# Altium schematic sheet Temp Supervisor.SchDoc
size A4
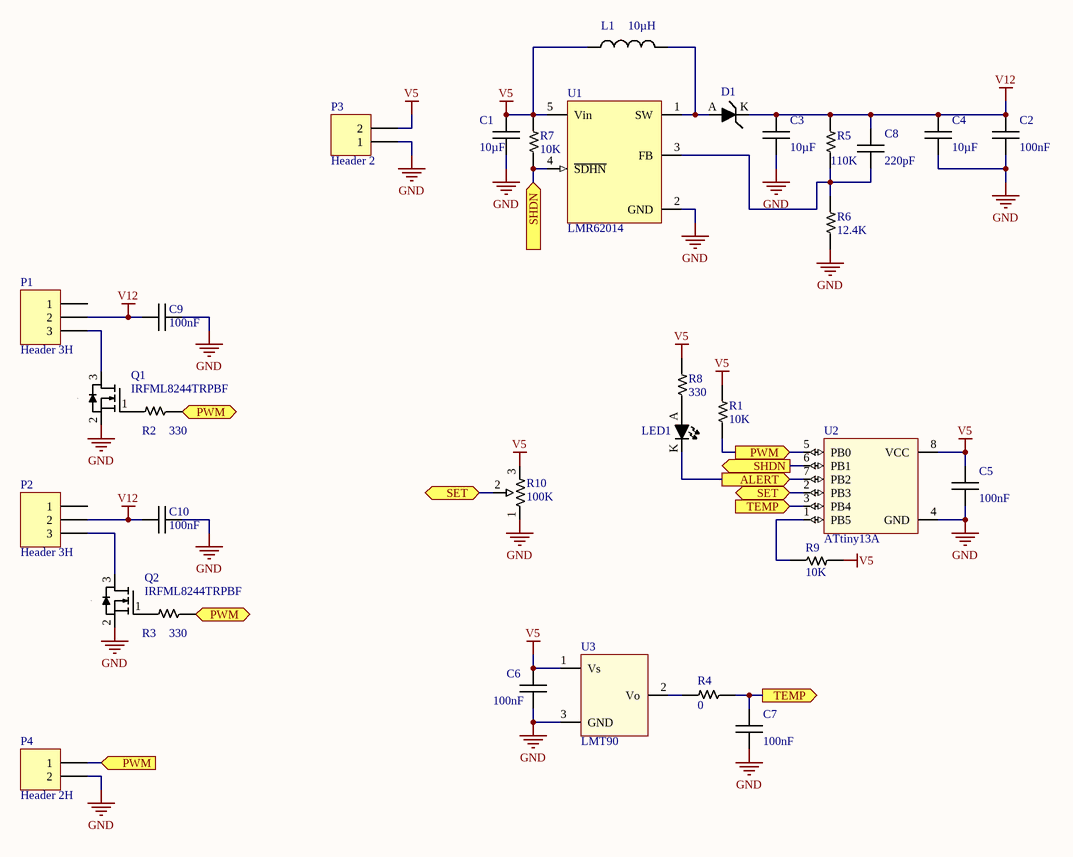
[diagram p0: Temp Supervisor.SchDoc]

## Parts
C1  10µF  [CAPC2012N]
C2  100nF  [CAPC1608N]
C3  10µF  [CAPC2012N]
C4  10µF  [CAPC2012N]
C5  100nF  [CAPC1608N]
C6  100nF  [CAPC1608N]
C7  100nF  [CAPC1608N]
C8  220pF  [CAPC1608N]
C9  100nF  [CAPC1608N]
C10  100nF  [CAPC1608N]
D1  (no value)  [DO-214AC]
L1  10µH  [INDUCTOR 6×6mm Taiyo Yuden]
LED1  (no value)  [LED 3216m]
P1  Header 3H  [HDR1X3H]
P2  Header 3H  [HDR1X3H]
P3  Header 2  [HDR1X2]
P4  Header 2H  [HDR1X2H]
Q1  IRFML8244TRPBF  [SOT23-3N]
Q2  IRFML8244TRPBF  [SOT23-3N]
R1  10K  [RESC1608N]
R2  330  [RESC1608N]
R3  330  [RESC1608N]
R4  0  [RESC1608N]
R5  110K  [RESC1608N]
R6  12.4K  [RESC1608N]
R7  10K  [RESC1608N]
R8  330  [RESC1608N]
R9  10K  [RESC1608N]
R10  100K  [Trim-Pot 2mm SMD]
U1  LMR62014  [SOT23-5AN]
U2  ATtiny13A  [SOIC127P600-8AN]
U3  LMT90  [SOT23-3N]

## Ports
ALERT (out), PWM (in), PWM (out), SET (bidir), SHDN (in), SHDN (out), TEMP (in), TEMP (out)

## Nets
GND: C1.1 C2.1 C3.1 C4.1 C5.1 C6.1 C7.1 C9.1 C10.1 P3.1 P4.2 Q1.2(S) Q2.2(S) R6.1 R10.1 U1.2(GND) U2.4(GND) U3.3(GND)
V5: C1.2 C5.2 C6.2 L1.1 P3.2 R1.2 R7.2 R8.2 R9.2 R10.3 U1.5(Vin) U2.8(VCC) U3.1(Vs)
V12: C2.2 C3.2 C4.2 C8.2 C9.2 C10.2 D1.K(Kathode) P1.2 P2.2 R5.2
ALERT: LED1.K U2.7(PB2) ; port ALERT
PWM: P4.1 R1.1 R2.1 R3.1 U2.5(PB0) ; port PWM
SET: R10.2 U2.2(PB3) ; port SET
SHDN: R7.1 U1.4(~{SDHN}) U2.6(PB1) ; port SHDN
TEMP: C7.2 R4.1 U2.3(PB4) ; port TEMP
NetC8_1: C8.1 R5.1 R6.2 U1.3(FB)
NetD1_A: D1.A(Anode) L1.2 U1.1(SW)
NetLED1_A: LED1.A R8.1
NetP1_3: P1.3 Q1.3(D)
NetP2_3: P2.3 Q2.3(D)
NetQ1_1: Q1.1(G) R2.2
NetQ2_1: Q2.1(G) R3.2
NetR4_2: R4.2 U3.2(Vo)
NetR9_1: R9.1 U2.1(PB5)

Not connected (* = marked no-connect by the designer): P1 1; P2 1

## Library data of the parts
C1-C10 = Capacitor: Voltage: 24V
  C1 C3 C4: Value: 10µF
  C2 C5-C7 C9 C10: Value: 100nF
  C8: Value: 220pF
D1 = Diode Schottky
L1 = Inductor: DC Current: 2A; Value: 10µH
LED1 = LED
P1 P2 = Header 3H: Header, 3-Pin, Right Angle; LatestRevisionDate: 17-Jul-2002; LatestRevisionNote: Re-released for DXP Platform.; Publisher: Altium Limited
P3 = Header 2: Header, 2-Pin; LatestRevisionDate: 17-Jul-2002; LatestRevisionNote: Re-released for DXP Platform.; Publisher: Altium Limited
P4 = Header 2H: Header, 2-Pin, Right Angle; LatestRevisionDate: 17-Jul-2002; LatestRevisionNote: Re-released for DXP Platform.; Publisher: Altium Limited
Q1 Q2 = MOSFET N-Ch enh: Vdss: 25V; Id: 5.8A; RdsON: 24m; Model: IRFML8244TRPBF
R1-R9 = Resistor
  R1 R7 R9: Value: 10K
  R2 R3 R8: Value: 330
  R4: Value: 0
  R5: Value: 110K
  R6: Value: 12.4K
R10 = Potentiometer: Value: 100K